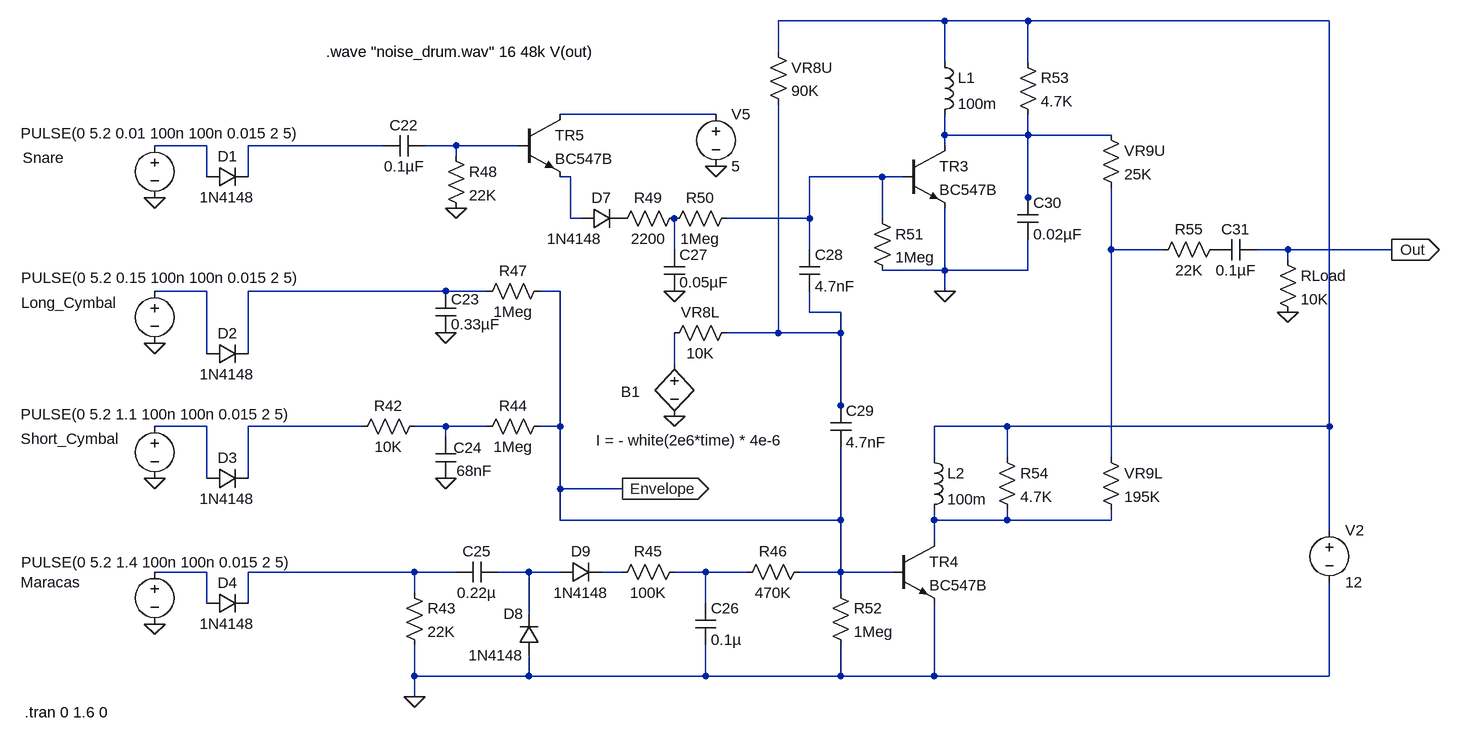
[diagram p0: schematic Practical-Electronics-1978-01_Pagina_24_Fig6.asc]
Practical-Electronics-1978-01_Pagina_24_Fig6.asc, the LTspice schematic file:
Version 4.1
SHEET 1 1636 680
WIRE 848 -752 592 -752
WIRE 976 -752 848 -752
WIRE 1440 -752 976 -752
WIRE 592 -704 592 -752
WIRE 848 -688 848 -752
WIRE 976 -688 976 -752
WIRE 496 -608 256 -608
WIRE 848 -576 848 -608
WIRE 976 -576 976 -608
WIRE 976 -576 848 -576
WIRE 1104 -576 976 -576
WIRE -288 -560 -368 -560
WIRE -16 -560 -224 -560
WIRE 96 -560 48 -560
WIRE 192 -560 96 -560
WIRE 848 -560 848 -576
WIRE 96 -544 96 -560
WIRE -288 -512 -288 -560
WIRE -224 -512 -224 -560
WIRE 272 -512 256 -512
WIRE 752 -512 640 -512
WIRE 784 -512 752 -512
WIRE 976 -480 976 -576
WIRE 976 -464 976 -480
WIRE 272 -448 272 -512
WIRE 288 -448 272 -448
WIRE 640 -448 640 -512
WIRE 640 -448 512 -448
WIRE 752 -448 752 -512
WIRE 432 -400 432 -448
WIRE 640 -400 640 -448
WIRE 1104 -400 1104 -496
WIRE 1184 -400 1104 -400
WIRE 1376 -400 1328 -400
WIRE 1536 -400 1376 -400
WIRE 1376 -384 1376 -400
WIRE 848 -368 848 -464
WIRE 848 -368 752 -368
WIRE 976 -368 976 -416
WIRE 976 -368 848 -368
WIRE -288 -336 -368 -336
WIRE 80 -336 -224 -336
WIRE 144 -336 80 -336
WIRE 256 -336 224 -336
WIRE 848 -336 848 -368
WIRE 640 -304 640 -336
WIRE 688 -304 640 -304
WIRE 80 -272 80 -288
WIRE 592 -272 592 -624
WIRE 592 -272 512 -272
WIRE 688 -272 688 -304
WIRE 688 -272 592 -272
WIRE -288 -240 -288 -336
WIRE -224 -240 -224 -336
WIRE 432 -224 432 -272
WIRE 688 -160 688 -272
WIRE 688 -144 688 -160
WIRE -288 -128 -368 -128
WIRE -48 -128 -224 -128
WIRE 80 -128 32 -128
WIRE 144 -128 80 -128
WIRE 256 -128 256 -336
WIRE 256 -128 224 -128
WIRE 944 -128 832 -128
WIRE 1440 -128 1440 -752
WIRE 1440 -128 944 -128
WIRE 80 -112 80 -128
WIRE 832 -80 832 -128
WIRE 944 -80 944 -128
WIRE 1104 -80 1104 -400
WIRE -288 -48 -288 -128
WIRE -224 -48 -224 -128
WIRE 256 -32 256 -128
WIRE 352 -32 256 -32
WIRE 256 16 256 -32
WIRE 688 16 688 -96
WIRE 688 16 256 16
WIRE 832 16 832 0
WIRE 944 16 944 0
WIRE 944 16 832 16
WIRE 1104 16 1104 0
WIRE 1104 16 944 16
WIRE 1440 32 1440 -128
WIRE 832 48 832 16
WIRE -288 96 -368 96
WIRE 32 96 -224 96
WIRE 96 96 32 96
WIRE 208 96 160 96
WIRE 256 96 208 96
WIRE 352 96 320 96
WIRE 480 96 432 96
WIRE 544 96 480 96
WIRE 688 96 688 16
WIRE 688 96 624 96
WIRE 768 96 688 96
WIRE 32 128 32 96
WIRE 688 128 688 96
WIRE -288 144 -288 96
WIRE -224 144 -224 96
WIRE 480 144 480 96
WIRE 208 160 208 96
WIRE 32 256 32 208
WIRE 208 256 208 224
WIRE 208 256 32 256
WIRE 480 256 480 208
WIRE 480 256 208 256
WIRE 688 256 688 208
WIRE 688 256 480 256
WIRE 832 256 832 144
WIRE 832 256 688 256
WIRE 1440 256 1440 112
WIRE 1440 256 832 256
WIRE 32 288 32 256
FLAG 32 288 0
FLAG 352 -32 Envelope
IOPIN 352 -32 Out
FLAG 1536 -400 Out
IOPIN 1536 -400 Out
FLAG 432 -144 0
FLAG 848 -336 0
FLAG 1376 -304 0
FLAG 80 -48 0
FLAG -368 -256 0
FLAG -368 -48 0
FLAG 496 -528 0
FLAG 432 -336 0
FLAG -368 -480 0
FLAG 96 -464 0
FLAG -368 176 0
FLAG 80 -272 0
SYMBOL res 16 112 R0
SYMATTR InstName R43
SYMATTR Value 22K
SYMBOL cap 160 80 R90
WINDOW 0 0 32 VBottom 2
WINDOW 3 32 32 VTop 2
SYMATTR InstName C25
SYMATTR Value 0.22µ
SYMATTR SpiceLine V=50
SYMBOL diode 256 112 R270
WINDOW 0 32 32 VTop 2
WINDOW 3 0 32 VBottom 2
SYMATTR InstName D9
SYMATTR Value 1N4148
SYMBOL diode 224 224 R180
WINDOW 0 24 64 Left 2
WINDOW 3 24 0 Left 2
SYMATTR InstName D8
SYMATTR Value 1N4148
SYMBOL res 448 80 R90
WINDOW 0 0 56 VBottom 2
WINDOW 3 32 56 VTop 2
SYMATTR InstName R45
SYMATTR Value 100K
SYMATTR SpiceLine tol=1 pwr=0.1
SYMBOL cap 464 144 R0
SYMATTR InstName C26
SYMATTR Value 0.1µ
SYMATTR SpiceLine V=50
SYMBOL res 640 80 R90
WINDOW 0 0 56 VBottom 2
WINDOW 3 32 56 VTop 2
SYMATTR InstName R46
SYMATTR Value 470K
SYMBOL res 672 112 R0
SYMATTR InstName R52
SYMATTR Value 1Meg
SYMATTR SpiceLine tol=1 pwr=0.1
SYMBOL voltage -368 80 R0
WINDOW 3 -205 1 Left 2
WINDOW 123 0 0 Left 0
WINDOW 39 -111 240 Left 2
WINDOW 0 -206 32 Left 2
SYMATTR Value PULSE(0 5.2 1.4 100n 100n 0.015 2 5)
SYMATTR InstName Maracas
SYMBOL npn3 768 48 R0
SYMATTR InstName TR4
SYMATTR Value BC547B
SYMBOL ind 816 -96 R0
SYMATTR InstName L2
SYMATTR Value 100m
SYMATTR SpiceLine Ipk=0.099 Rser=61.662 Rpar=9.42e+06 Cpar=0 mfg="Coilcraft" pn="PCH-45X-107"
SYMBOL res 928 -96 R0
SYMATTR InstName R54
SYMATTR Value 4.7K
SYMBOL voltage 1440 16 R0
WINDOW 123 0 0 Left 0
WINDOW 39 0 0 Left 0
SYMATTR InstName V2
SYMATTR Value 12
SYMBOL cap 624 -400 R0
SYMATTR InstName C28
SYMATTR Value 4.7nF
SYMBOL bv 432 -240 R0
WINDOW 3 -121 133 Left 2
WINDOW 0 -82 59 Left 2
SYMATTR Value I = - white(2e6*time) * 4e-6
SYMATTR InstName B1
SYMBOL cap 1328 -416 R90
WINDOW 0 0 32 VBottom 2
WINDOW 3 32 32 VTop 2
SYMATTR InstName C31
SYMATTR Value 0.1µF
SYMBOL res 1280 -416 R90
WINDOW 0 0 56 VBottom 2
WINDOW 3 32 56 VTop 2
SYMATTR InstName R55
SYMATTR Value 22K
SYMBOL res 1360 -400 R0
SYMATTR InstName RLoad
SYMATTR Value 10K
SYMBOL npn3 784 -560 R0
SYMATTR InstName TR3
SYMATTR Value BC547B
SYMBOL cap 672 -160 R0
SYMATTR InstName C29
SYMATTR Value 4.7nF
SYMBOL res 736 -464 R0
SYMATTR InstName R51
SYMATTR Value 1Meg
SYMATTR SpiceLine tol=1 pwr=0.1
SYMBOL ind 832 -704 R0
SYMATTR InstName L1
SYMATTR Value 100m
SYMATTR SpiceLine Ipk=0.099 Rser=61.662 Rpar=9.42e+06 Cpar=0 mfg="Coilcraft" pn="PCH-45X-107"
SYMBOL res 960 -704 R0
SYMATTR InstName R53
SYMATTR Value 4.7K
SYMBOL cap 960 -480 R0
SYMATTR InstName C30
SYMATTR Value 0.02µF
SYMBOL res 1088 -592 R0
SYMATTR InstName VR9U
SYMATTR Value 25K
SYMBOL res 1088 -96 R0
SYMATTR InstName VR9L
SYMATTR Value 195K
SYMBOL res 48 -144 R90
WINDOW 0 0 56 VBottom 2
WINDOW 3 32 56 VTop 2
SYMATTR InstName R42
SYMATTR Value 10K
SYMATTR SpiceLine tol=1 pwr=0.1
SYMBOL res 240 -144 R90
WINDOW 0 0 56 VBottom 2
WINDOW 3 32 56 VTop 2
SYMATTR InstName R44
SYMATTR Value 1Meg
SYMBOL cap 64 -112 R0
WINDOW 0 28 17 Left 2
WINDOW 3 33 52 Left 2
SYMATTR InstName C24
SYMATTR Value 68nF
SYMBOL cap 64 -336 R0
WINDOW 0 24 12 Left 2
WINDOW 3 24 51 Left 2
SYMATTR InstName C23
SYMATTR Value 0.33µF
SYMBOL res 240 -352 R90
WINDOW 0 0 56 VBottom 2
WINDOW 3 32 56 VTop 2
SYMATTR InstName R47
SYMATTR Value 1Meg
SYMBOL voltage -368 -352 R0
WINDOW 3 -205 -5 Left 2
WINDOW 123 0 0 Left 0
WINDOW 39 0 0 Left 0
WINDOW 0 -205 34 Left 2
SYMATTR Value PULSE(0 5.2 0.15 100n 100n 0.015 2 5)
SYMATTR InstName Long_Cymbal
SYMBOL voltage -368 -144 R0
WINDOW 0 -206 35 Left 2
WINDOW 3 -206 -3 Left 2
WINDOW 123 0 0 Left 0
WINDOW 39 -138 157 Left 2
SYMATTR InstName Short_Cymbal
SYMATTR Value PULSE(0 5.2 1.1 100n 100n 0.015 2 5)
SYMBOL npn3 192 -608 R0
SYMATTR InstName TR5
SYMATTR Value BC547B
SYMBOL voltage 496 -624 R0
WINDOW 123 0 0 Left 0
WINDOW 39 0 0 Left 0
SYMATTR InstName V5
SYMATTR Value 5
SYMBOL diode 288 -432 R270
WINDOW 0 32 32 VTop 2
WINDOW 3 0 -10 VBottom 2
SYMATTR InstName D7
SYMATTR Value 1N4148
SYMBOL res 448 -464 R90
WINDOW 0 0 56 VBottom 2
WINDOW 3 32 56 VTop 2
SYMATTR InstName R49
SYMATTR Value 2200
SYMBOL res 528 -464 R90
WINDOW 0 0 56 VBottom 2
WINDOW 3 32 56 VTop 2
SYMATTR InstName R50
SYMATTR Value 1Meg
SYMBOL cap 416 -400 R0
WINDOW 3 24 50 Left 2
SYMATTR Value 0.05µF
SYMATTR InstName C27
SYMBOL res 80 -560 R0
SYMATTR InstName R48
SYMATTR Value 22K
SYMBOL cap 48 -576 R90
WINDOW 0 0 32 VBottom 2
WINDOW 3 32 32 VTop 2
SYMATTR InstName C22
SYMATTR Value 0.1µF
SYMBOL voltage -368 -576 R0
WINDOW 3 -206 -3 Left 2
WINDOW 123 0 0 Left 0
WINDOW 39 0 0 Left 0
WINDOW 0 -203 35 Left 2
SYMATTR Value PULSE(0 5.2 0.01 100n 100n 0.015 2 5)
SYMATTR InstName Snare
SYMBOL diode -288 -496 R270
WINDOW 0 32 32 VTop 2
WINDOW 3 0 32 VBottom 2
SYMATTR InstName D1
SYMATTR Value 1N4148
SYMBOL diode -288 -224 R270
WINDOW 0 32 32 VTop 2
WINDOW 3 0 32 VBottom 2
SYMATTR InstName D2
SYMATTR Value 1N4148
SYMBOL diode -288 -32 R270
WINDOW 0 32 32 VTop 2
WINDOW 3 0 32 VBottom 2
SYMATTR InstName D3
SYMATTR Value 1N4148
SYMBOL diode -288 160 R270
WINDOW 0 32 32 VTop 2
WINDOW 3 0 32 VBottom 2
SYMATTR InstName D4
SYMATTR Value 1N4148
SYMBOL res 576 -720 R0
SYMATTR InstName VR8U
SYMATTR Value 90K
SYMBOL res 416 -256 R270
WINDOW 0 32 56 VTop 2
WINDOW 3 0 56 VBottom 2
SYMATTR InstName VR8L
SYMATTR Value 10K
TEXT -104 -704 Left 2 !.wave "noise_drum.wav" 16 48k V(out)
TEXT -568 312 Left 2 !.tran 0 1.6 0

The netlist it stands for:
* Practical-Electronics-1978-01_Pagina_24_Fig6.asc
R43 N020 0 22K
C25 N021 N020 0.22µ V=50
D9 N021 N022 1N4148
D8 0 N021 1N4148
R45 N023 N022 100K tol=1 pwr=0.1
C26 N023 0 0.1µ V=50
R46 Envelope N023 470K
R52 Envelope 0 1Meg tol=1 pwr=0.1
V§Maracas N019 0 PULSE(0 5.2 1.4 100n 100n 0.015 2 5)
Q§TR4 N018 Envelope 0 0 BC547B
L2 N001 N018 100m Ipk=0.099 Rser=61.662 Rpar=9.42e+06 Cpar=0 mfg="Coilcraft" pn="PCH-45X-107"
R54 N001 N018 4.7K
V2 N001 0 12
C28 N008 N013 4.7nF
B1 N014 0 I = - white(2e6*time) * 4e-6
C31 Out P001 0.1µF
R55 P001 N010 22K
RLoad Out 0 10K
Q§TR3 N003 N008 0 0 BC547B
C29 N013 Envelope 4.7nF
R51 N008 0 1Meg tol=1 pwr=0.1
L1 N001 N003 100m Ipk=0.099 Rser=61.662 Rpar=9.42e+06 Cpar=0 mfg="Coilcraft" pn="PCH-45X-107"
R53 N001 N003 4.7K
C30 N003 0 0.02µF
R§VR9U N003 N010 25K
R§VR9L N010 N018 195K
R42 N017 N016 10K tol=1 pwr=0.1
R44 Envelope N017 1Meg
C24 N017 0 68nF
C23 N012 0 0.33µF
R47 Envelope N012 1Meg
V§Long_Cymbal N011 0 PULSE(0 5.2 0.15 100n 100n 0.015 2 5)
V§Short_Cymbal N015 0 PULSE(0 5.2 1.1 100n 100n 0.015 2 5)
Q§TR5 N002 N006 N007 0 BC547B
V5 N002 0 5
D7 N007 P002 1N4148
R49 N009 P002 2200
R50 N008 N009 1Meg
C27 N009 0 0.05µF
R48 N006 0 22K
C22 N006 N005 0.1µF
V§Snare N004 0 PULSE(0 5.2 0.01 100n 100n 0.015 2 5)
D1 N004 N005 1N4148
D2 N011 N012 1N4148
D3 N015 N016 1N4148
D4 N019 N020 1N4148
R§VR8U N001 N013 90K
R§VR8L N014 N013 10K
.model D D
.lib standard.dio
.model NPN NPN
.model PNP PNP
.lib standard.bjt
.wave "noise_drum.wav" 16 48k V(out)
.tran 0 1.6 0
.backanno
.end